# EAGLE design LTC4425 breakout (EAGLE 9.0.1)
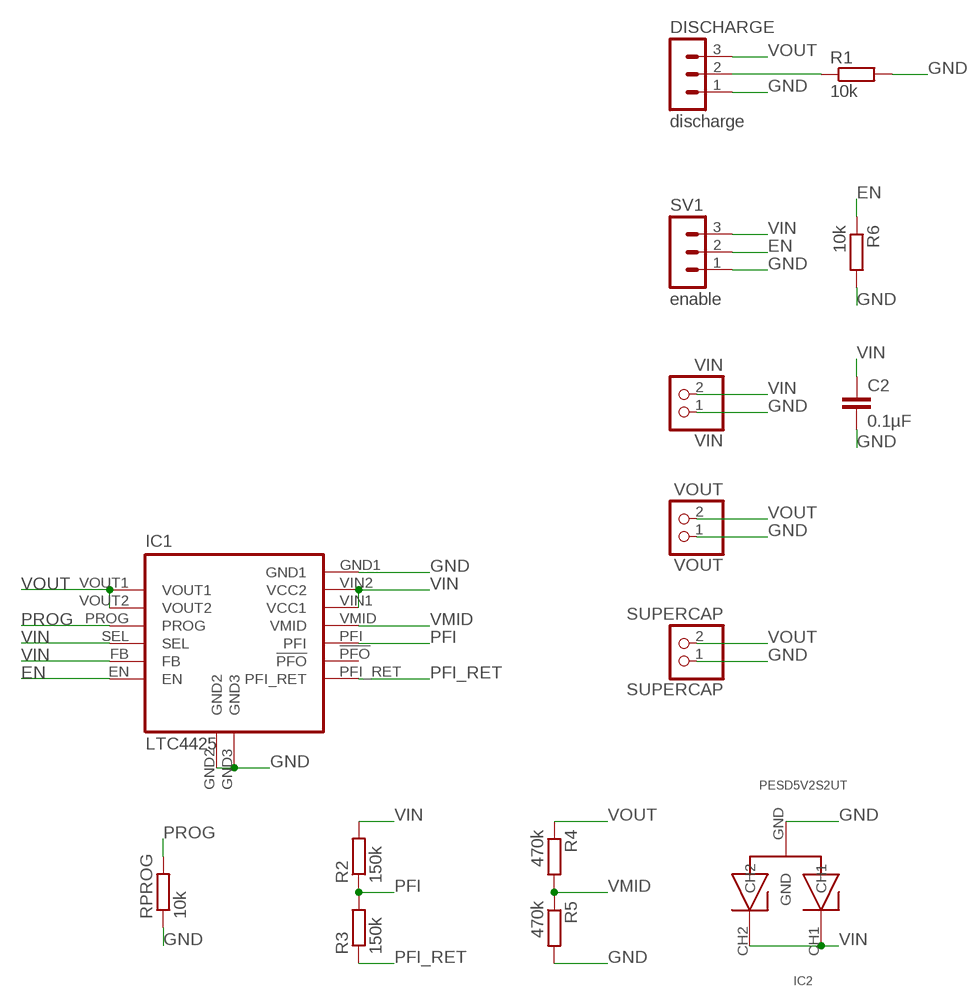
[diagram p0: schematic, sheet 1]

## Parts
C2  0.1µF  C-EUC0805  [C0805]
DISCHARGE  discharge  MA03-1  [MA03-1]
IC1  LTC4425  [MSOP]
IC2  PESD5V2S2UT  PESDXS2UT  [SOT-23]
R1  10k  R-EU_R1206  [R1206]
R2  150k  R-EU_R0805  [R0805]
R3  150k  R-EU_R0805  [R0805]
R4  470k  R-EU_R0805  [R0805]
R5  470k  R-EU_R0805  [R0805]
R6  10k  R-EU_R0805  [R0805]
RPROG  10k  R-EU_R1206  [R1206]
SUPERCAP  SUPERCAP  PINHD-1X2  [1X02]
SV1  enable  MA03-1  [MA03-1]
VIN  VIN  PINHD-1X2  [1X02]
VOUT  VOUT  PINHD-1X2  [1X02]

## Nets
EN: IC1.EN R6.1 SV1.2
GND: C2.2 DISCHARGE.1 IC1.GND1 IC1.GND2 IC1.GND3 IC2.GND R1.2 R5.2 R6.2 RPROG.1 SUPERCAP.1 SV1.1 VIN.1 VOUT.1
N$2: DISCHARGE.2 R1.1
PFI: IC1.PFI R2.1 R3.2
PFI_RET: IC1.PFI_RET R3.1
PROG: IC1.PROG RPROG.2
VIN: C2.1 IC1.FB IC1.SEL IC1.VIN1(VCC1) IC1.VIN2(VCC2) IC2.CH1 IC2.CH2 R2.2 SV1.3 VIN.2
VMID: IC1.VMID R4.2 R5.1
VOUT: DISCHARGE.3 IC1.VOUT1 IC1.VOUT2 R4.1 SUPERCAP.2 VOUT.2
Unconnected: IC1.!PFO!

## Library data of the parts
C2 = rcl:C-EU: CAPACITOR, European symbol; SPICEPREFIX: C
DISCHARGE SV1 = con-lstb:MA03-1: PIN HEADER; OC_FARNELL: unknown; OC_NEWARK: unknown
IC1 = LTC4425 Supercap Charger:LTC4425: The ISL85003 and ISL85003A are synchronous buck regulators with integrated high-side and low-side FET’s. The regulator can operate from an input voltage range of 4.5V to 18V while delivering a very efficient continuous 3A current. This is all delivered in a very compact 3x4mm DFN package. More about it you can find at ISL85003 <http://www.intersil.com/en/products/power-management/switching-regulators/integrated-fet-regulators/ISL85003.html> The library has been designed by Richard Magdycz <https://www.facebook.com/groups/eaglecadsoftUK>
IC2 = PESDxS2UT:PESDXS2UT
R1-R6 RPROG = rcl:R-EU_: RESISTOR, European symbol; SPICEPREFIX: R
SUPERCAP VIN VOUT = pinhead:PINHD-1X2: PIN HEADER

## Board
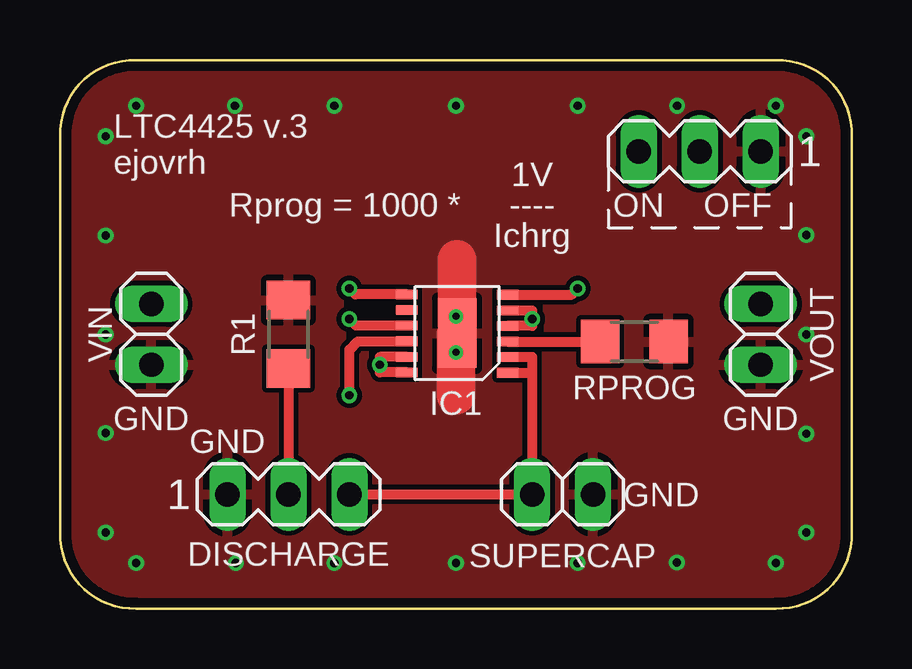
[diagram p1: board, top side]
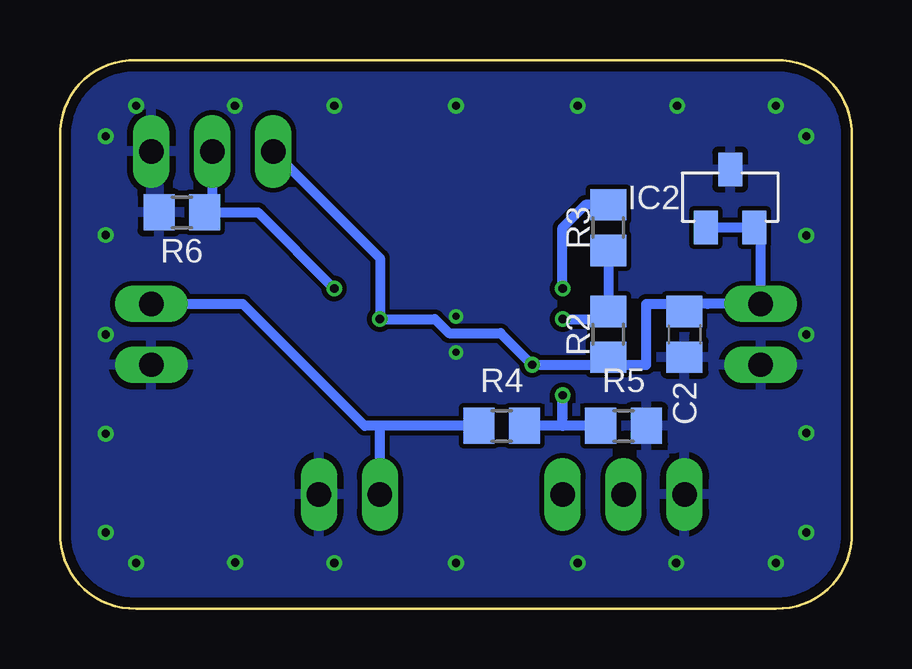
[diagram p2: board, bottom side, seen from below]

Size 33.02 x 22.86 mm. Coordinates in mm from the lower left corner, seen from the top.
Outline: 29.84,0 arc92 33.02,3.17 33.02,19.68 arc92 29.84,22.86 3.17,22.86 arc92 0,19.68 0,3.17 arc92 3.17,0 29.84,0
Copper layers (1*16): Top 0.035mm / dielectric 1.5mm / Bottom 0.035mm
Design rules "markovac_2layer *": minimum track width 0.2mm, minimum drill 0.3mm, track to track 0.2mm, track to pad 0.2mm, pad to pad 0.2mm, via to via 0.2mm, smd to smd 0.2mm, copper to edge 16mil, drill to drill 8mil, minimum pad ring 0.15mm, minimum via ring 0.15mm, stop-mask expansion 4mil, vias tented up to drill 25mil, thermal gap 10mil

### Footprints (pad centres in the part's own frame; a part is rotated, then mirrored left to right if it is on the bottom)
C0805 = smd 1.3 x 1.5: 1 -0.95,0; 2 0.95,0
MA03-1 = drill 1.016 long: 1 -2.54,0; 2 0,0; 3 2.54,0
MSOP = smd 0.4 x 0.9: !PFO! 1.01,2.05; EN 1.65,-2.15; FB 1,-2.15; PFI 0.36,2.05; PFI_RET 1.66,2.05; PROG -0.3,-2.15; SEL 0.35,-2.15; VIN1 -0.94,2.05; VIN2 -1.59,2.05; VMID -0.29,2.05; VOUT1 -1.6,-2.15; VOUT2 -0.95,-2.15 | smd 2.9 x 1.6: GND1 0.05,-0.05 | drill 0.3: GND2 -0.75,0; GND3 0.75,0
SOT-23 = smd 1 x 1.4: CH1 -1.016,-1.262; CH2 1.016,-1.262; GND 0,1.151
R1206 = smd 1.6 x 1.803: 1 -1.422,0; 2 1.422,0
R0805 = smd 1.3 x 1.5: 1 -0.95,0; 2 0.95,0
1X02 = drill 1.016 long: 1 -1.27,0; 2 1.27,0

### Placement (x,y rotation side)
C2  6.99,11.43 270 bottom
DISCHARGE  9.53,4.76 0 top
IC1  16.51,11.43 90 top
IC2  5.08,17.14 0 bottom
R1  9.53,11.43 90 top
R2  10.16,11.43 270 bottom
R3  10.16,15.88 270 bottom
R4  14.61,7.62 0 bottom
R5  9.53,7.62 0 bottom
R6  27.94,16.51 180 bottom
RPROG  23.95,11.13 180 top
SUPERCAP  20.95,4.76 180 top
SV1  26.67,19.05 180 top
VIN  3.81,11.43 90 top
VOUT  29.21,11.43 90 top

### Tracks (layer width: path | path; a pad name or v marks a point on that pad's centre or on a via)
EN  (via drill 0.35)
  Top 0.406: IC1.EN 21.34,13.08 v21.59,13.34
  Bottom 0.406: R6.1 26.67,16.51 | 26.67,16.51 24.77,16.51 v21.59,13.34 | 26.67,16.83 SV1.2 26.67,16.51
GND  (via drill 0.35)
  Top 0.406: 16.56,14.55 16.51,14.61
  Top 1.6: 16.56,14.55 IC1.GND1 16.51,11.43 16.51,8.89
  other vias: 3.17,1.91 1.91,3.17 1.91,19.68 29.84,20.95 3.17,20.95 31.11,19.68 31.11,3.17 29.84,1.91 31.11,11.43 1.91,11.43 1.91,7.32 1.91,15.54 31.11,15.57 31.11,7.29 25.72,1.93 21.59,1.91 21.59,20.95 25.73,20.95 7.29,20.95 11.43,20.95 7.33,1.91 11.43,1.91 16.51,20.95 16.51,1.91
  pour Bottom: 33.02,22.86 0,22.86 0,0 33.02,0
  pour Top: 33.02,22.86 0,22.86 0,0 33.02,0
N$2
  Top 0.406: R1.1 DISCHARGE.2
PFI  (via drill 0.35)
  Top 0.406: IC1.PFI 12.34,11.79 v12.06,12.06
  Bottom 0.406: R3.2 R2.1 10.16,12.06 v12.06,12.06
PFI_RET  (via drill 0.35)
  Top 0.406: IC1.PFI_RET 12.31,13.09 v12.06,13.34
  Bottom 0.406: v12.06,13.34 12.06,15.88 11.12,16.82 R3.1
PROG
  Top 0.406: IC1.PROG RPROG.2
VIN  (via drill 0.35)
  Top 0.406: IC1.VIN1 13.34,10.49 v13.34,10.16 13.34,9.84 IC1.VIN2 | IC1.SEL 19.68,11.78 v19.68,12.06 19.68,12.43 IC1.FB
  Bottom 0.406: IC2.CH1 IC2.CH2 3.81,15.63 VIN.2 | 10.16,10.16 v13.34,10.16 14.65,11.48 16.8,11.48 17.39,12.06 v19.68,12.06 19.68,14.61 SV1.3 | VIN.2 6.03,12.7 | VIN.2 6.99,12.7 | C2.1 6.99,12.7 | 6.99,12.7 8.57,12.7 8.57,10.16 10.16,10.16 | R2.2 10.16,10.16
VMID  (via drill 0.35)
  Top 0.406: v12.06,8.89 12.06,10.79 12.41,11.14 IC1.VMID
  Bottom 0.406: R5.1 12.06,7.62 | 12.06,7.62 R4.2 | 12.06,7.95 v12.06,8.89 12.06,7.62
VOUT
  Top 0.406: IC1.VOUT2 19.68,10.48 19.68,9.83 | IC1.VOUT1 19.68,9.83 | 19.68,9.83 SUPERCAP.2 DISCHARGE.3
  Bottom 0.406: VOUT.2 25.4,12.7 20.32,7.62 19.68,7.62 | R4.1 19.68,7.62 | SUPERCAP.2 19.68,7.62

### Text on the board
tPlace: LTC4425 v.3 / ejovrh | 1V | Rprog = 1000 * | ---- | ON | OFF | Ichrg | GND | GND | GND | GND
Measures: Rprog